# EAGLE schematic imu_v3 (EAGLE 5.11)
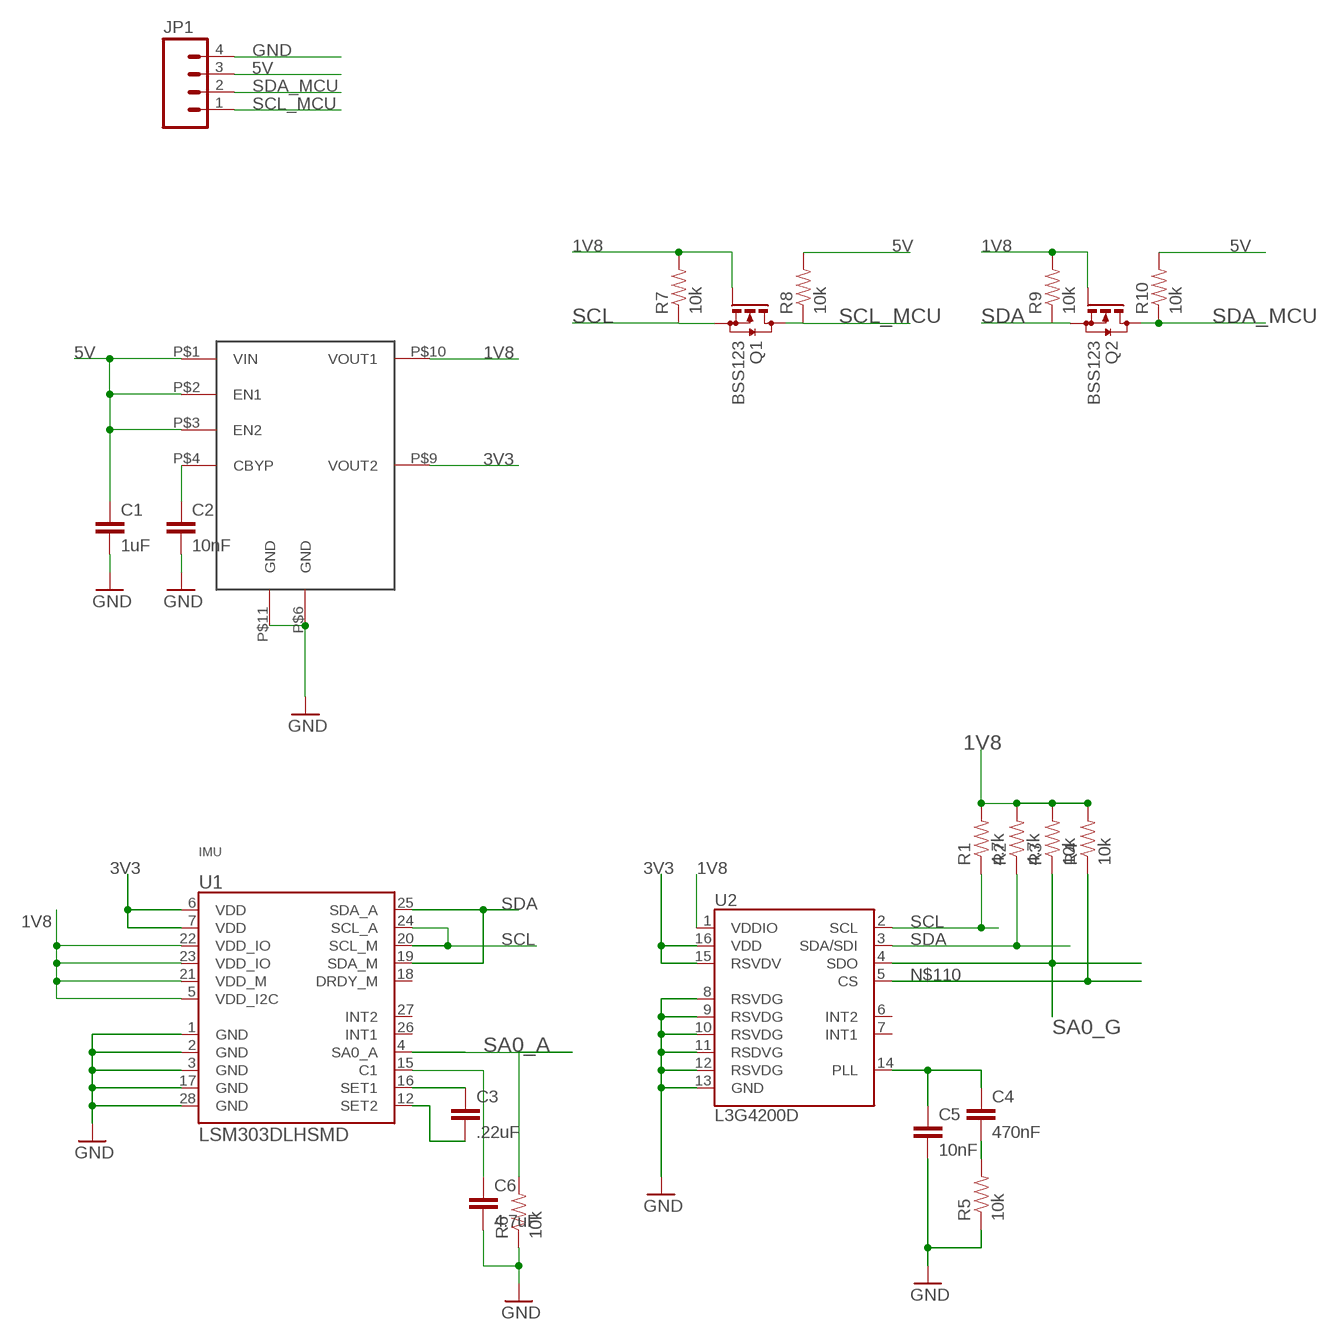
[diagram p0: schematic, sheet 1]

## Parts
C1  1uF  CAP0805  [0805]
C2  10nF  CAP0805  [0805]
C3  .22uF  CAP0805  [0805]
C4  470nF  CAP0805  [0805]
C5  10nF  CAP0805  [0805]
C6  4.7uF  CAP0805  [0805]
JP1  M04PTH  [1X04]
Q1  BSS123  [SOT23]
Q2  BSS123  [SOT23]
R1  4.7k  RESISTOR0805-RES  [0805]
R2  4.7k  RESISTOR0805-RES  [0805]
R3  10k  RESISTOR0805-RES  [0805]
R4  10k  RESISTOR0805-RES  [0805]
R5  10k  RESISTOR0805-RES  [0805]
R6  10k  RESISTOR0805-RES  [0805]
R7  10k  RESISTOR0805-RES  [0805]
R8  10k  RESISTOR0805-RES  [0805]
R9  10k  RESISTOR0805-RES  [0805]
R10  10k  RESISTOR0805-RES  [0805]
U1  LSM303DLHSMD  [LGA28-5X5]
U2  L3G4200D  [LGA16-4X4]
U$1  LP5996  [LLP-10]

## Nets
1V8: Q1.1(G) Q2.1(G) R1.2 R2.2 R3.2 R4.2 R7.2 R9.2 U1.5(VDD_I2C) U1.21(VDD_M) U1.22(VDD_IO) U1.23(VDD_IO) U2.1(VDDIO) U$1.P$10(VOUT1)
3V3: U1.6(VDD) U1.7(VDD) U2.15(RSVDV) U2.16(VDD) U$1.P$9(VOUT2)
5V: C1.1 JP1.3 R8.2 R10.2 U$1.P$1(VIN) U$1.P$2(EN1) U$1.P$3(EN2)
GND: C1.2 C2.2 C5.2 C6.2 JP1.4 R5.1 R6.1 U1.1(GND) U1.2(GND) U1.3(GND) U1.17(GND) U1.28(GND) U2.8(RSVDG) U2.9(RSVDG) U2.10(RSVDG) U2.11(RSDVG) U2.12(RSVDG) U2.13(GND) U$1.P$6(GND) U$1.P$11(GND)
N$1: C6.1 U1.15(C1)
N$97: C3.1 U1.16(SET1)
N$98: C3.2 U1.12(SET2)
N$102: C4.1 C5.1 U2.14(PLL)
N$103: C4.2 R5.2
N$109: C2.1 U$1.P$4(CBYP)
N$110: R4.1 U2.5(CS)
SA0_A: R6.2 U1.4(SA0_A)
SA0_G: R3.1 U2.4(SDO)
SCL: Q1.2(S) R1.1 R7.1 U1.20(SCL_M) U1.24(SCL_A) U2.2(SCL)
SCL_MCU: JP1.1 Q1.3(D) R8.1
SDA: Q2.2(S) R2.1 R9.1 U1.19(SDA_M) U1.25(SDA_A) U2.3(SDA/SDI)
SDA_MCU: JP1.2 Q2.3(D) R10.1
Unconnected: U1.18(DRDY_M) U1.26(INT1) U1.27(INT2) U2.6(INT2) U2.7(INT1)

## Notes on the sheet
- IMU

## Library data of the parts
C1-C6 = SparkFun:CAP: Capacitor Standard 0603 ceramic capacitor, and 0.1" leaded capacitor.
JP1 = SparkFun:M04: Header 4 Standard 4-pin 0.1" header. Use with straight break away headers (SKU : PRT-00116), right angle break away headers (PRT-00553), swiss pins (PRT-00743), machine pins (PRT-00117), and female headers (PRT-00115). Molex polarized connector foot print use with SKU : PRT-08231 with associated crimp pins and housings.
Q1 Q2 = transistor-small-signal:BSS123: N-CHANNEL MOS FET
R1-R10 = SparkFun:RESISTOR: Resistor Basic schematic elements and footprints for 0603, 1206, and PTH resistors.
U1 = imu:LSM303DLH
U2 = SparkFun:L3G4200D: L3G4200D Three-axis, digital output gyroscope The L3G4200D is a low-power three-axis angular rate sensor, has a full scale of ±250/±500/±2000 dps and is capable of measuring rates with a user-selectable bandwidth. It includes a sensing element and an IC interface capable of providing the measured angular rate to the external world through a digital interface (I2C/SPI). Package: 4x4x1.1 LGA-16 (LGA16-4x4.PAC)
U$1 = pcbqr:LP5996

## Net classes
1 power: width 0.406 mm